# Altium schematic sheet TOP.SchDoc
size A2
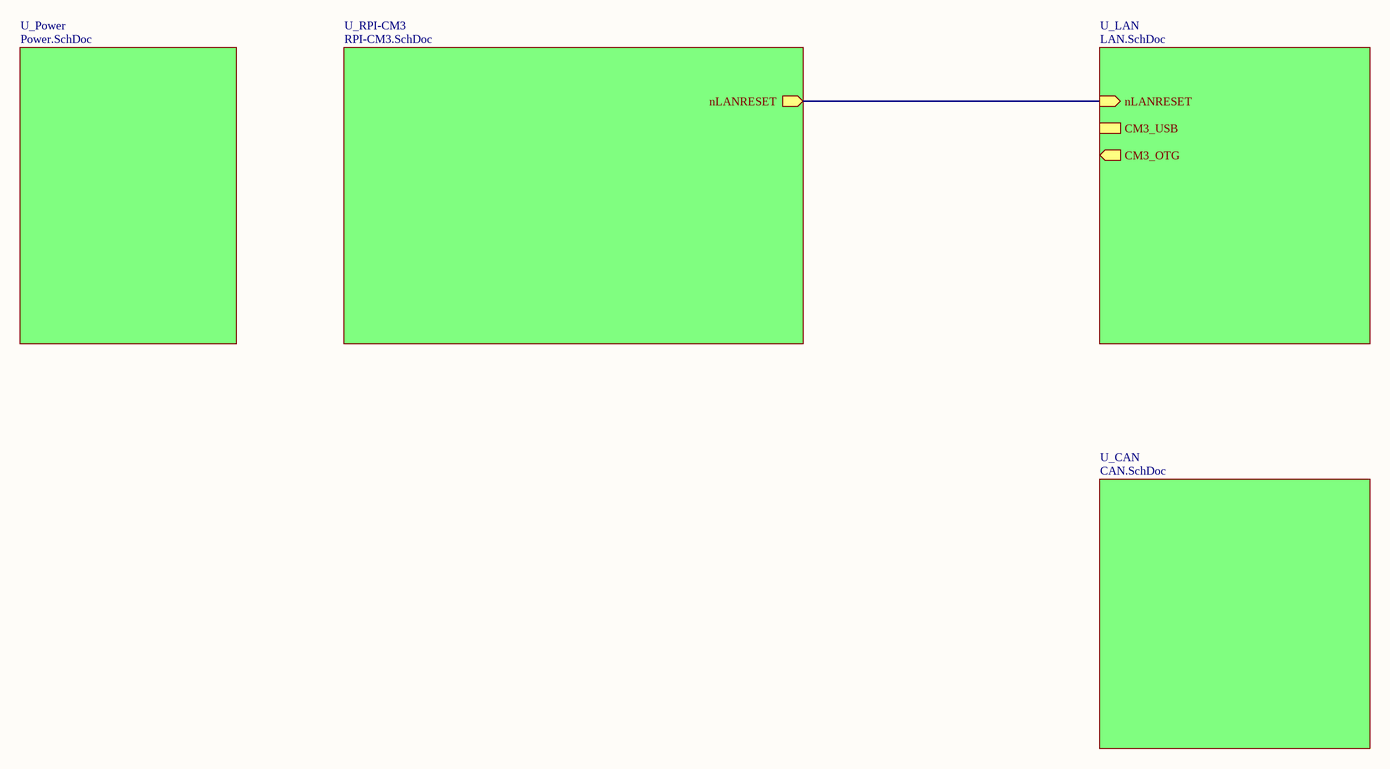
[diagram p0: TOP.SchDoc]

## Sub-sheets
U_CAN = CAN.SchDoc: no entries
U_LAN = LAN.SchDoc: nLANRESET (in), CM3_OTG (out), CM3_USB (harness CM3_USB)
U_Power = Power.SchDoc: no entries
U_RPI-CM3 = RPI-CM3.SchDoc: nLANRESET (out)

## Nets
(unnamed): sheet U_RPI-CM3/nLANRESET, sheet U_LAN/nLANRESET

## Notes on the sheet
- Title
- Size:
- Date:
- A3
- Number:
- Time:
- Revision:
- Sheet
- of
- File: